# EAGLE schematic HA_FONA_LARA_20 (EAGLE 9.6.1)
COMPANY: Hardware Art; DRAWN: SMT; REV: A
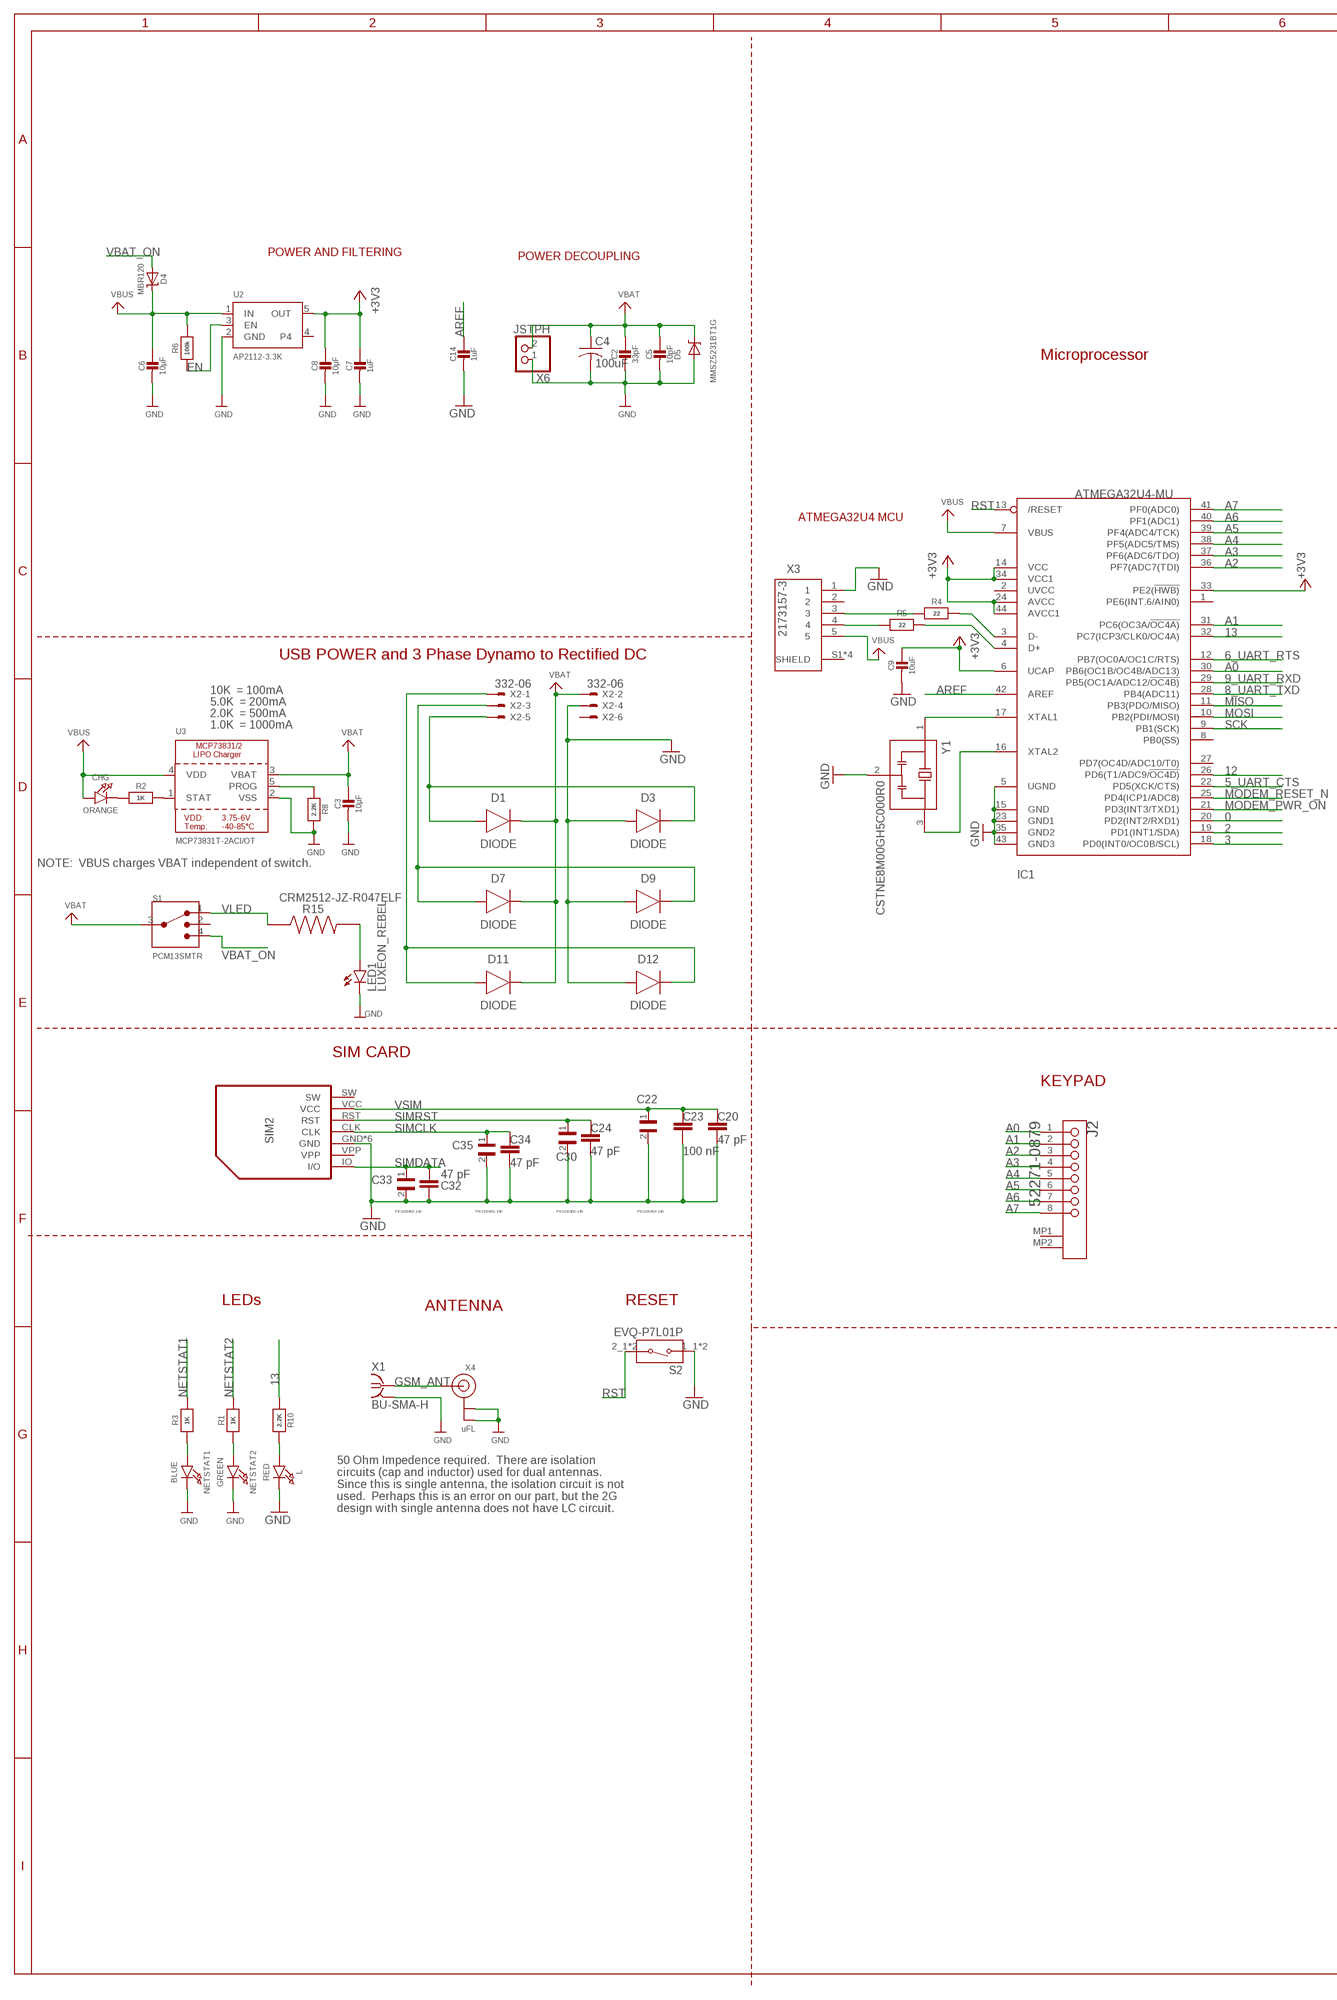
[diagram p0: schematic, sheet 1, part 1 of 2]
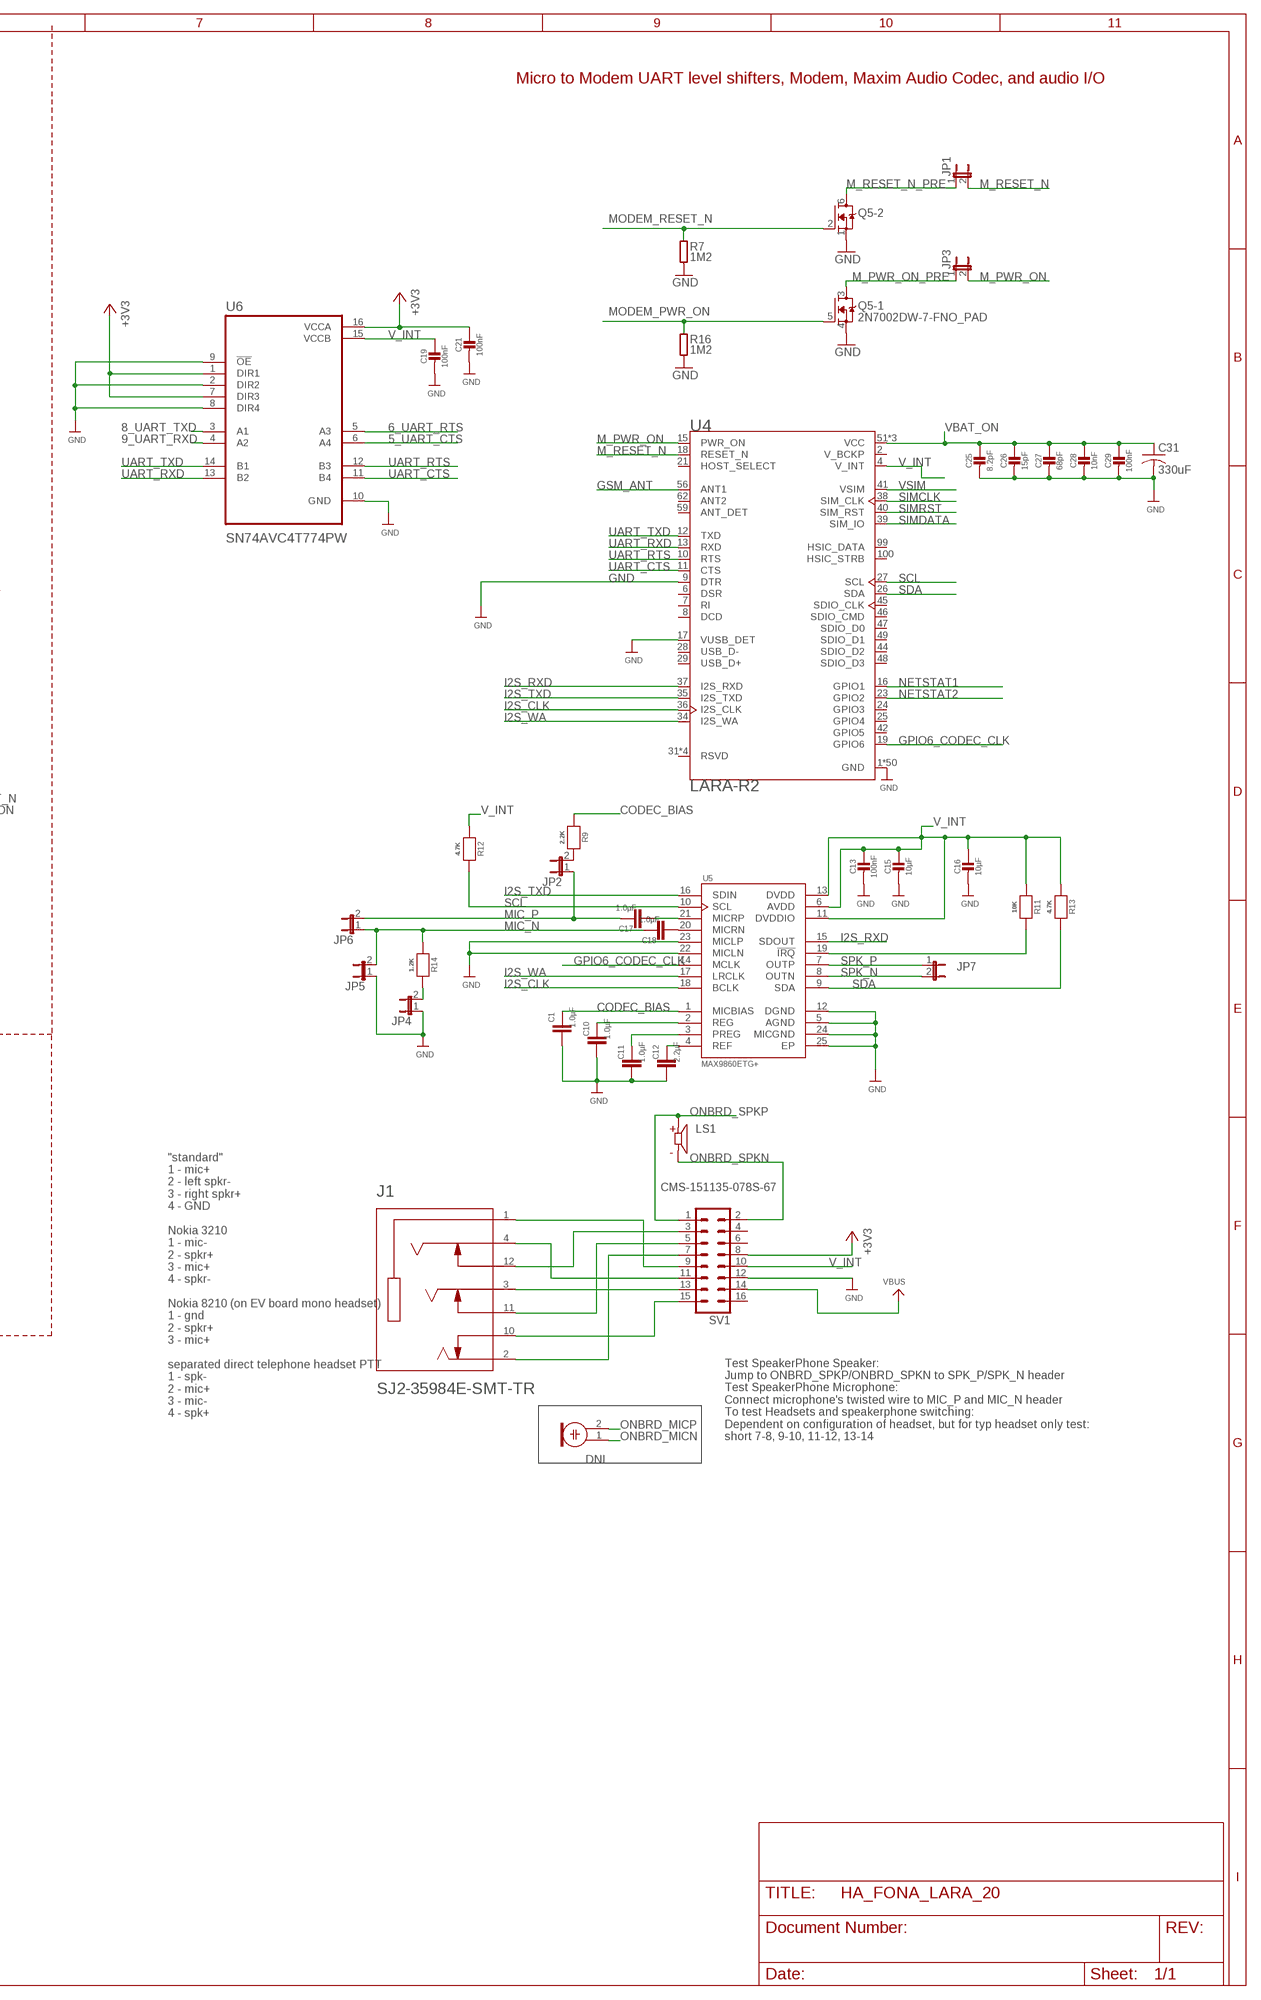
[diagram p1: schematic, sheet 1, part 2 of 2]

## Parts
C1  1.0µF  C_CHIP-0402(1005-METRIC)  [CAPC1005X60]
C2  33pF  CAP_CERAMIC0805-NOOUTLINE  [0805-NO]
C3  10µF  CAP_CERAMIC0805-NOOUTLINE  [0805-NO]
C4  100uF  C-USC1210  [C1210]
C5  10pF  CAP_CERAMIC0805-NOOUTLINE  [0805-NO]
C6  10µF  CAP_CERAMIC0805-NOOUTLINE  [0805-NO]
C7  1uF  CAP_CERAMIC0603_NO  [0603-NO]
C8  10µF  CAP_CERAMIC0805-NOOUTLINE  [0805-NO]
C9  10uF  CAP_CERAMIC_0805MP  [_0805MP]
C10  1.0µF  C_CHIP-0402(1005-METRIC)  [CAPC1005X60]
C11  1.0µF  C_CHIP-0402(1005-METRIC)  [CAPC1005X60]
C12  2.2µF  C_CHIP-0603(1608-METRIC)  [CAPC1608X85]
C13  100nF  CAP_CERAMIC0805-NOOUTLINE  [0805-NO]
C14  1uF  CAP_CERAMIC0603_NO  [0603-NO]
C15  10µF  CAP_CERAMIC0805-NOOUTLINE  [0805-NO]
C16  10µF  CAP_CERAMIC0805-NOOUTLINE  [0805-NO]
C17  1.0µF  C_CHIP-0402(1005-METRIC)  [CAPC1005X60]
C18  1.0µF  C_CHIP-0402(1005-METRIC)  [CAPC1005X60]
C19  100nF  CAP_CERAMIC_0402  [_0402]
C20  47 pF  C_CHIP-0402(1005-METRIC)  [CAPC1005X60]
C21  100nF  CAP_CERAMIC_0402  [_0402]
C22  PESD0402-140  [RESC1005X35N]
C23  100 nF  C_CHIP-0402(1005-METRIC)  [CAPC1005X60]
C24  47 pF  C_CHIP-0402(1005-METRIC)  [CAPC1005X60]
C25  8.2pF  CAP_CERAMIC_0402  [_0402]
C26  15pF  CAP_CERAMIC_0402  [_0402]
C27  68pF  CAP_CERAMIC_0402  [_0402]
C28  10nF  CAP_CERAMIC_0402  [_0402]
C29  100nF  CAP_CERAMIC_0402  [_0402]
C30  PESD0402-140  [RESC1005X35N]
C31  330uF  C-USC1210  [C1210]
C32  47 pF  C_CHIP-0402(1005-METRIC)  [CAPC1005X60]
C33  PESD0402-140  [RESC1005X35N]
C34  47 pF  C_CHIP-0402(1005-METRIC)  [CAPC1005X60]
C35  PESD0402-140  [RESC1005X35N]
CHG  ORANGE  LED0805_NOOUTLINE  [CHIPLED_0805_NOOUTLINE]
D1  DIODE  DIODEDO-214AA(SMB)  [DIOM5336X265N]
D3  DIODE  DIODEDO-214AA(SMB)  [DIOM5336X265N]
D4  MBR120  DIODE-SCHOTTKYSOD-123  [SOD-123]
D5  MMSZ5231BT1G  DIODE-ZENERSOD123  [SOD-123]
D7  DIODE  DIODEDO-214AA(SMB)  [DIOM5336X265N]
D9  DIODE  DIODEDO-214AA(SMB)  [DIOM5336X265N]
D11  DIODE  DIODEDO-214AA(SMB)  [DIOM5336X265N]
D12  DIODE  DIODEDO-214AA(SMB)  [DIOM5336X265N]
IC1  ATMEGA32U4-MU  [TQFN44_7MM]
J1  SJ2-35984E-SMT-TR  [CUI_SJ2-35984E-SMT-TR]
J2  MOLEX_52271-0879MOLEX_52271-0879_0_0  [MOLEX_52271-0879_0]
JP1  JP1E  [JP1]
JP2  JP1E  [JP1]
JP3  JP1E  [JP1]
JP4  JP1E  [JP1]
JP5  JP1E  [JP1]
JP6  JP1E  [JP1]
JP7  JP1E  [JP1]
L  RED  MICROBUILDER_LED0603  [MICROBUILDER_CHIPLED_0603]
LED1  LUXEON_REBEL  [LUXEON_REBEL]
LS1  CMS-151135-078S-67  [SPKR_CMS-151135-078S-67]
M2  ELECTRET_MICROPHON-WM-61A  [WM-61A]
NETSTAT1  BLUE  LED0805_NOOUTLINE  [CHIPLED_0805_NOOUTLINE]
NETSTAT2  GREEN  LED0805_NOOUTLINE  [CHIPLED_0805_NOOUTLINE]
Q5  2N7002DW-7-FNO_PAD  [PWR_SC70-6L2]
R1  1K  RESISTOR_0603_NOOUT  [0603-NO]
R2  1K  RESISTOR_0603_NOOUT  [0603-NO]
R3  1K  RESISTOR_0603_NOOUT  [0603-NO]
R4  22  RESISTOR_0603_NOOUT  [0603-NO]
R5  22  RESISTOR_0603_NOOUT  [0603-NO]
R6  100k  RESISTOR_0603_NOOUT  [0603-NO]
R7  1M2  R-1M2-0402  [0402-1005X55N]
R8  2.2K  RESISTOR_0603_NOOUT  [0603-NO]
R9  2.2K  RESISTOR_0603_NOOUT  [0603-NO]
R10  2.2K  RESISTOR_0603_NOOUT  [0603-NO]
R11  10K  RESISTOR_0603_NOOUT  [0603-NO]
R12  4.7K  RESISTOR_0603_NOOUT  [0603-NO]
R13  4.7K  RESISTOR_0603_NOOUT  [0603-NO]
R14  1.2K  RESISTOR_0603_NOOUT  [0603-NO]
R15  CRM2512-JZ-R047ELF  [RESC6331X80N]
R16  1M2  R-1M2-0402  [0402-1005X55N]
S1  PCM13SMTR  [SW_PCM13SMTR]
S2  EVQ-P7L01P  [SW_EVQ-P7L01P]
SIM2  -  SIM  [MICROSIM8]
SV1  MA08-2  [MA08-2]
U2  AP2112-3.3K  VREG_SOT23-5  [SOT23-5]
U3  MCP73831T-2ACI/OT  MCP73831/2  [SOT23-5]
U4  LARA-R2  [XCVR_LARA-R2]
U5  MAX9860ETG+  [QFN50P400X400X75-25N]
U6  SN74AVC4T774PW  [SOP65P640X120-16N]
X1  BU-SMA-H  [BU-SMA-H]
X2  332-06  [332-06]
X3  2173157-3  [CONN_2173157-3]
X4  uFL  ANTENNA_U.FL  [U.FL]
X6  JSTPH  CON_JST_PH_2PIN  [JSTPH2]
Y1  CSTNE8M00GH5C000R0  [OSC_CSTNE8M00GH5C000R0]

## Nets
0: IC1.20(PD2(INT2/RXD1))
2: IC1.19(PD1(INT1/SDA))
3: IC1.18(PD0(INT0/OC0B/SCL))
5_UART_CTS: IC1.22(PD5(XCK/CTS)) U6.6(A4)
6_UART_RTS: IC1.12(PB7(OC0A/OC1C/RTS)) U6.5(A3)
8_UART_TXD: IC1.28(PB4(ADC11)) U6.3(A1)
9_UART_RXD: IC1.29(PB5(OC1A/ADC12/!OC4B)) U6.4(A2)
12: IC1.26(PD6(T1/ADC9/!OC4D))
13: IC1.32(PC7(ICP3/CLK0/OC4A)) R10.1
+3V3: C7.1 C8.1 C9.1 C21.1 IC1.6(UCAP) IC1.14(VCC) IC1.24(AVCC) IC1.33(PE2(!HWB)) IC1.34(VCC1) IC1.44(AVCC1) SV1.8 U2.5(OUT) U6.1(DIR1) U6.7(DIR3) U6.16(VCCA)
A0: IC1.30(PB6(OC1B/OC4B/ADC13)) J2.1
A1: IC1.31(PC6(OC3A/!OC4A)) J2.2
A2: IC1.36(PF7(ADC7(TDI)) J2.3
A3: IC1.37(PF6(ADC6/TDO)) J2.4
A4: IC1.38(PF5(ADC5/TMS)) J2.5
A5: IC1.39(PF4(ADC4/TCK)) J2.6
A6: IC1.40(PF1(ADC1)) J2.7
A7: IC1.41(PF0(ADC0)) J2.8
AREF: C14.1 IC1.42(AREF)
CODEC_BIAS: C1.1 R9.1 U5.1(MICBIAS)
D+: IC1.4(D+) R5.2
D-: IC1.3(D-) R4.2
EN: R6.1 U2.3(EN)
GND: C1.2 C2.2 C3.2 C4.2 C5.2 C6.2 C7.2 C8.2 C9.2 C10.2 C11.2 C12.2 C13.2 C14.2 C15.2 C16.2 C19.2 C20.2 C21.2 C22.2 C23.2 C24.2 C25.2 C26.2 C27.2 C28.2 C29.2 C30.2 C31.2 C32.2 C33.2 C34.2 C35.2 D3.2(A) D5.A D9.2(A) D12.2(A) IC1.5(UGND) IC1.15(GND) IC1.23(GND1) IC1.35(GND2) IC1.43(GND3) JP4.1 JP5.1 L.C LED1.C LED1.C@1(C) NETSTAT1.C NETSTAT2.C Q5.1(-2:S) Q5.4(-1:S) R7.1 R8.2 R16.1 S2.1_1 S2.1_2 SIM2.GND SIM2.SH1(GND) SIM2.SH2(GND) SIM2.SH3(GND) SIM2.SH4(GND) SIM2.SH5(GND) SV1.12 U2.2(GND) U3.2(VSS) U4.1(GND) U4.3(GND) U4.5(GND) U4.9(DTR) U4.14(GND) U4.17(VUSB_DET) U4.20(GND) U4.22(GND) U4.30(GND) U4.32(GND) U4.43(GND) U4.50(GND) U4.54(GND) U4.55(GND) U4.57(GND) U4.58(GND) U4.60(GND) U4.61(GND) U4.63(GND) U4.64(GND) U4.65(GND) U4.66(GND) U4.67(GND) U4.68(GND) U4.69(GND) U4.70(GND) U4.71(GND) U4.72(GND) U4.73(GND) U4.74(GND) U4.75(GND) U4.76(GND) U4.77(GND) U4.78(GND) U4.79(GND) U4.80(GND) U4.81(GND) U4.82(GND) U4.83(GND) U4.84(GND) U4.85(GND) U4.86(GND) U4.87(GND) U4.88(GND) U4.89(GND) U4.90(GND) U4.91(GND) U4.92(GND) U4.93(GND) U4.94(GND) U4.95(GND) U4.96(GND) U5.5(AGND) U5.12(DGND) U5.22(MICLN) U5.23(MICLP) U5.24(MICGND) U5.25(EP) U6.2(DIR2) U6.8(DIR4) U6.9(!OE) U6.10(GND) X1.2 X1.3 X1.4 X1.5 X2.4 X3.1 X4.1(GND) X4.2(GND) X6.1 Y1.2(GND)
GPIO6_CODEC_CLK: U4.19(GPIO6) U5.14(MCLK)
GSM_ANT: U4.56(ANT1) X1.1 X4.3(SIGNAL)
I2S_CLK: U4.36(I2S_CLK) U5.18(BCLK)
I2S_RXD: U4.37(I2S_RXD) U5.15(SDOUT)
I2S_TXD: U4.35(I2S_TXD) U5.16(SDIN)
I2S_WA: U4.34(I2S_WA) U5.17(LRCLK)
M_PWR_ON: JP3.2 U4.15(PWR_ON)
M_PWR_ON_PRE: JP3.1 Q5.3(-1:D)
M_RESET_N: JP1.2 U4.18(RESET_N)
M_RESET_N_PRE: JP1.1 Q5.6(-2:D)
MIC_N: C18.1 JP5.2 JP6.1 R14.1
MIC_P: C17.1 JP2.1 JP6.2
MISO: IC1.11(PB3(PDO/MISO))
MODEM_PWR_ON: IC1.21(PD3(INT3/TXD1)) Q5.5(-1:G) R16.2
MODEM_RESET_N: IC1.25(PD4(ICP1/ADC8)) Q5.2(-2:G) R7.2
MOSI: IC1.10(PB2(PDI/MOSI))
N$1: CHG.C R2.1
N$2: L.A R10.2
N$3: R2.2 U3.1(STAT)
N$4: R8.1 U3.5(PROG)
N$5: NETSTAT2.A R1.1
N$6: D11.2(A) D12.1(C) X2.1
N$8: C17.2 U5.21(MICRP)
N$9: NETSTAT1.A R3.1
N$10: C12.1 U5.4(REF)
N$11: IC1.16(XTAL2) Y1.3(OUT)
N$12: IC1.17(XTAL1) Y1.1(IN)
N$13: C11.1 U5.3(PREG)
N$14: C10.1 U5.2(REG)
N$15: R5.1 X3.4
N$16: R4.1 X3.3
N$17: C18.2 U5.20(MICRN)
N$18: R11.2 U5.19(!IRQ)
N$20: JP2.2 R9.2
N$21: JP4.2 R14.2
N$22: D7.2(A) D9.1(C) X2.3
N$23: D1.2(A) D3.1(C) X2.5
N$24: J1.11(RING1_SWITCH) SV1.5
N$25: LED1.A LED1.A@1(A) R15.2
N$26: J1.12(RING2_SWITCH) SV1.3
N$27: J1.2(TIP) SV1.7
N$28: J1.1(SLEEVE) SV1.9
N$29: J1.4(RING2) SV1.11
N$30: J1.3(RING1) SV1.13
N$31: J1.10(TIP_SWITCH) SV1.15
NETSTAT1: R3.2 U4.16(GPIO1)
NETSTAT2: R1.2 U4.23(GPIO2)
ONBRD_MICN: M2.1
ONBRD_MICP: M2.2
ONBRD_SPKN: LS1.M SV1.2
ONBRD_SPKP: LS1.P SV1.1
RST: IC1.13(/RESET) S2.2_1 S2.2_2
SCK: IC1.9(PB1(SCK))
SCL: R12.2 U4.27(SCL) U5.10(SCL)
SDA: R13.2 U4.26(SDA) U5.9(SDA)
SIMCLK: C34.1 C35.1 SIM2.CLK U4.38(SIM_CLK)
SIMDATA: C32.1 C33.1 SIM2.IO(I/O) U4.39(SIM_IO)
SIMRST: C24.1 C30.1 SIM2.RST U4.40(SIM_RST)
SPK_N: JP7.2 U5.8(OUTN)
SPK_P: JP7.1 U5.7(OUTP)
UART_CTS: U4.11(CTS) U6.11(B4)
UART_RTS: U4.10(RTS) U6.12(B3)
UART_RXD: U4.13(RXD) U6.13(B2)
UART_TXD: U4.12(TXD) U6.14(B1)
V_INT: C13.1 C15.1 C16.1 C19.1 R11.1 R12.1 R13.1 SV1.10 U4.4(V_INT) U5.6(AVDD) U5.11(DVDDIO) U5.13(DVDD) U6.15(VCCB)
VBAT: C2.1 C3.1 C4.1 C5.1 D1.1(C) D5.C D7.1(C) D11.1(C) S1.3 U3.3(VBAT) X2.2 X6.2
VBAT_ON: C25.1 C26.1 C27.1 C28.1 C29.1 C31.1 D4.A S1.4 U4.51(VCC) U4.52(VCC) U4.53(VCC)
VBUS: C6.1 CHG.A D4.C IC1.7(VBUS) R6.2 SV1.14 U2.1(IN) U3.4(VDD) X3.5
VLED: R15.1 S1.1
VSIM: C20.1 C22.1 C23.1 SIM2.VCC U4.41(VSIM)
Unconnected: IC1.1(PE6(INT.6/AIN0)) IC1.2(UVCC) IC1.8(PB0(SS)) IC1.27(PD7(OC4D/ADC10/T0)) J2.MP1 J2.MP2 LED1.TH LED1.TH@1(TH) LED1.TH@2(TH) LED1.TH@3(TH) LED1.TH@4(TH) S1.2 SIM2.SW SIM2.VPP SV1.4 SV1.6 SV1.16 U2.4 U4.6(DSR) U4.7(RI) U4.8(DCD) U4.21(HOST_SELECT) U4.24(GPIO3) U4.25(GPIO4) U4.28(USB_D-) U4.29(USB_D+) U4.31(RSVD) U4.33(RSVD) U4.42(GPIO5) U4.44(SDIO_D2) U4.45(SDIO_CLK) U4.46(SDIO_CMD) U4.47(SDIO_D0) U4.48(SDIO_D3) U4.49(SDIO_D1) U4.59(ANT_DET) U4.62(ANT2) U4.97(RSVD) U4.98(RSVD) U4.99(HSIC_DATA) U4.100(HSIC_STRB) X2.6 X3.2 X3.S1(SHIELD) X3.S2(SHIELD) X3.S3(SHIELD) X3.S4(SHIELD)

## Notes on the sheet
- Micro to Modem UART level shifters, Modem, Maxim Audio Codec, and audio I/O
- POWER AND FILTERING | POWER DECOUPLING
- Microprocessor
- ATMEGA32U4 MCU
- USB POWER and 3 Phase Dynamo to Rectified DC
- 10K  = 100mA
- 5.0K  = 200mA
- 2.0K  = 500mA
- 1.0K  = 1000mA
- NOTE:  VBUS charges VBAT independent of switch.
- SIM CARD
- KEYPAD
- LEDs | ANTENNA | RESET
- "standard"
  1 - mic+
  2 - left spkr-
  3 - right spkr+
  4 - GND
  
  Nokia 3210
  1 - mic-
  2 - spkr+
  3 - mic+
  4 - spkr-
  
  Nokia 8210 (on EV board mono headset)
  1 - gnd
  2 - spkr+
  3 - mic+
  
  separated direct telephone headset PTT
  1 - spk-
  2 - mic+
  3 - mic-
  4 - spk+
- Test SpeakerPhone Speaker:
  Jump to ONBRD_SPKP/ONBRD_SPKN to SPK_P/SPK_N header
  Test SpeakerPhone Microphone:
  Connect microphone's twisted wire to MIC_P and MIC_N header
  To test Headsets and speakerphone switching:
  Dependent on configuration of headset, but for typ headset only test: 
  short 7-8, 9-10, 11-12, 13-14
- DNI
- 50 Ohm Impedence required.  There are isolation
  circuits (cap and inductor) used for dual antennas.
  Since this is single antenna, the isolation circuit is not
  used.  Perhaps this is an error on our part, but the 2G
  design with single antenna does not have LC circuit.

## Power pins joined to a net without a drawn wire
V_BCKP: U4.2(V_BCKP)

## Library data of the parts
C1 C12 = Capacitor:C: Capacitor - Generic; CATEGORY: Capacitor; MF: KEMET; MPN: T491A225K016AT; OC_NEWARK: 97H5553
C2 = microbuilder:CAP_CERAMIC: Ceramic Capacitors For new designs, use the packages preceded by an '_' character since they are more reliable: The following footprints should be used on most boards: _0402 - Standard footprint for regular board layouts _0603 - Standard footprint for regular board layouts _0805 - Standard footprint for regular board layouts _1206 - Standard footprint for regular board layouts For extremely tight-pitch boards where space is at a premium, the following 'micro-pitch' footprints can be used (smaller pads, no silkscreen outline, etc.): _0402MP - Micro-pitch footprint for very dense/compact boards _0603MP - Micro-pitch footprint for very dense/compact boards _0805MP - Micro-pitch footprint for very dense/compact boards _1206MP - Micro-pitch footprint for very dense/compact boards; MF: AVX; MPN: 04025A330JAT2A; OC_NEWARK: 96M1150
C3 C6 C8 C9 C15 C16 = microbuilder:CAP_CERAMIC: Ceramic Capacitors For new designs, use the packages preceded by an '_' character since they are more reliable: The following footprints should be used on most boards: _0402 - Standard footprint for regular board layouts _0603 - Standard footprint for regular board layouts _0805 - Standard footprint for regular board layouts _1206 - Standard footprint for regular board layouts For extremely tight-pitch boards where space is at a premium, the following 'micro-pitch' footprints can be used (smaller pads, no silkscreen outline, etc.): _0402MP - Micro-pitch footprint for very dense/compact boards _0603MP - Micro-pitch footprint for very dense/compact boards _0805MP - Micro-pitch footprint for very dense/compact boards _1206MP - Micro-pitch footprint for very dense/compact boards; MF: AVX; MPN: 08053D106KAT2A; OC_NEWARK: 37T9053
C4 = rcl:C-US: CAPACITOR, American symbol; MF: KEMET; MPN: C1210C107M8PACTU; OC_NEWARK: 87X8674
C5 = microbuilder:CAP_CERAMIC: Ceramic Capacitors For new designs, use the packages preceded by an '_' character since they are more reliable: The following footprints should be used on most boards: _0402 - Standard footprint for regular board layouts _0603 - Standard footprint for regular board layouts _0805 - Standard footprint for regular board layouts _1206 - Standard footprint for regular board layouts For extremely tight-pitch boards where space is at a premium, the following 'micro-pitch' footprints can be used (smaller pads, no silkscreen outline, etc.): _0402MP - Micro-pitch footprint for very dense/compact boards _0603MP - Micro-pitch footprint for very dense/compact boards _0805MP - Micro-pitch footprint for very dense/compact boards _1206MP - Micro-pitch footprint for very dense/compact boards; MF: KEMET; MPN: C0805C100D5GACTU; OC_NEWARK: 07X0850
C7 C14 = microbuilder:CAP_CERAMIC: Ceramic Capacitors For new designs, use the packages preceded by an '_' character since they are more reliable: The following footprints should be used on most boards: _0402 - Standard footprint for regular board layouts _0603 - Standard footprint for regular board layouts _0805 - Standard footprint for regular board layouts _1206 - Standard footprint for regular board layouts For extremely tight-pitch boards where space is at a premium, the following 'micro-pitch' footprints can be used (smaller pads, no silkscreen outline, etc.): _0402MP - Micro-pitch footprint for very dense/compact boards _0603MP - Micro-pitch footprint for very dense/compact boards _0805MP - Micro-pitch footprint for very dense/compact boards _1206MP - Micro-pitch footprint for very dense/compact boards; MF: AVX; MPN: 02016D104KAT2A; OC_NEWARK: 85K9474
C10 C11 C17 C18 = Capacitor:C: Capacitor - Generic; CATEGORY: Capacitor; MF: AVX; MPN: 02016D104KAT2A; OC_NEWARK: 85K9474
C13 = microbuilder:CAP_CERAMIC: Ceramic Capacitors For new designs, use the packages preceded by an '_' character since they are more reliable: The following footprints should be used on most boards: _0402 - Standard footprint for regular board layouts _0603 - Standard footprint for regular board layouts _0805 - Standard footprint for regular board layouts _1206 - Standard footprint for regular board layouts For extremely tight-pitch boards where space is at a premium, the following 'micro-pitch' footprints can be used (smaller pads, no silkscreen outline, etc.): _0402MP - Micro-pitch footprint for very dense/compact boards _0603MP - Micro-pitch footprint for very dense/compact boards _0805MP - Micro-pitch footprint for very dense/compact boards _1206MP - Micro-pitch footprint for very dense/compact boards; MF: AVX; MPN: 08055C104KAT2A; OC_NEWARK: 95W1480
C19 C21 C29 = microbuilder:CAP_CERAMIC: Ceramic Capacitors For new designs, use the packages preceded by an '_' character since they are more reliable: The following footprints should be used on most boards: _0402 - Standard footprint for regular board layouts _0603 - Standard footprint for regular board layouts _0805 - Standard footprint for regular board layouts _1206 - Standard footprint for regular board layouts For extremely tight-pitch boards where space is at a premium, the following 'micro-pitch' footprints can be used (smaller pads, no silkscreen outline, etc.): _0402MP - Micro-pitch footprint for very dense/compact boards _0603MP - Micro-pitch footprint for very dense/compact boards _0805MP - Micro-pitch footprint for very dense/compact boards _1206MP - Micro-pitch footprint for very dense/compact boards; MF: TDK; MPN: C1005X7R1C104K050BC; OC_NEWARK: 90R7598
C20 C23 C24 C32 C34 = Capacitor:C: Capacitor - Generic; CATEGORY: Capacitor
C22 C30 C33 C35 = PESD0402-140:PESD0402-140: PESD0402 Series 40 V 0.25 pF Bi-Directional Surface Mount ESD Protector Check prices <https://pricing.snapeda.com/search/part/PESD0402-140/?ref=eda>; AVAILABILITY: Good; DESCRIPTION: 40V Clamp Ipp Tvs Diode Surface Mount 0402; MF: Littelfuse Inc.; MP: PESD0402-140; PACKAGE: 0402 Littelfuse; PRICE: None; PURCHASE-URL: https://pricing.snapeda.com/search/part/PESD0402-140/?ref=eda
C25 = microbuilder:CAP_CERAMIC: Ceramic Capacitors For new designs, use the packages preceded by an '_' character since they are more reliable: The following footprints should be used on most boards: _0402 - Standard footprint for regular board layouts _0603 - Standard footprint for regular board layouts _0805 - Standard footprint for regular board layouts _1206 - Standard footprint for regular board layouts For extremely tight-pitch boards where space is at a premium, the following 'micro-pitch' footprints can be used (smaller pads, no silkscreen outline, etc.): _0402MP - Micro-pitch footprint for very dense/compact boards _0603MP - Micro-pitch footprint for very dense/compact boards _0805MP - Micro-pitch footprint for very dense/compact boards _1206MP - Micro-pitch footprint for very dense/compact boards; MF: NIC COMPONENTS; MPN: NMC0402NPO8R2C50TRPF; OC_NEWARK: 18AH4170
C26 = microbuilder:CAP_CERAMIC: Ceramic Capacitors For new designs, use the packages preceded by an '_' character since they are more reliable: The following footprints should be used on most boards: _0402 - Standard footprint for regular board layouts _0603 - Standard footprint for regular board layouts _0805 - Standard footprint for regular board layouts _1206 - Standard footprint for regular board layouts For extremely tight-pitch boards where space is at a premium, the following 'micro-pitch' footprints can be used (smaller pads, no silkscreen outline, etc.): _0402MP - Micro-pitch footprint for very dense/compact boards _0603MP - Micro-pitch footprint for very dense/compact boards _0805MP - Micro-pitch footprint for very dense/compact boards _1206MP - Micro-pitch footprint for very dense/compact boards; MF: MULTICOMP PRO; MPN: MCMT15N150F500CT; OC_NEWARK: 03AC2879
C27 = microbuilder:CAP_CERAMIC: Ceramic Capacitors For new designs, use the packages preceded by an '_' character since they are more reliable: The following footprints should be used on most boards: _0402 - Standard footprint for regular board layouts _0603 - Standard footprint for regular board layouts _0805 - Standard footprint for regular board layouts _1206 - Standard footprint for regular board layouts For extremely tight-pitch boards where space is at a premium, the following 'micro-pitch' footprints can be used (smaller pads, no silkscreen outline, etc.): _0402MP - Micro-pitch footprint for very dense/compact boards _0603MP - Micro-pitch footprint for very dense/compact boards _0805MP - Micro-pitch footprint for very dense/compact boards _1206MP - Micro-pitch footprint for very dense/compact boards; MF: KEMET; MPN: C0603C680J3GACAUTO; OC_NEWARK: 77Y7549
C28 = microbuilder:CAP_CERAMIC: Ceramic Capacitors For new designs, use the packages preceded by an '_' character since they are more reliable: The following footprints should be used on most boards: _0402 - Standard footprint for regular board layouts _0603 - Standard footprint for regular board layouts _0805 - Standard footprint for regular board layouts _1206 - Standard footprint for regular board layouts For extremely tight-pitch boards where space is at a premium, the following 'micro-pitch' footprints can be used (smaller pads, no silkscreen outline, etc.): _0402MP - Micro-pitch footprint for very dense/compact boards _0603MP - Micro-pitch footprint for very dense/compact boards _0805MP - Micro-pitch footprint for very dense/compact boards _1206MP - Micro-pitch footprint for very dense/compact boards; MF: AVX; MPN: 06035C103KAT2A; OC_NEWARK: 36K3729
C31 = rcl:C-US: CAPACITOR, American symbol; MF: MURATA; MPN: GRM32EC80E337ME05L; OC_NEWARK: 01AC8870
CHG = microbuilder:LED: LED 0603 - 0603 Surface Mount Package 2mA: Green LED - Low Power (3.9mcd, 2ma, 1.7Vf) - Digikey: 475-2709-2-ND Orange LED - Low Power (9.8mcd, 2ma, 1.8Vf) - Digikey: 475-1194-2-ND Red LED - Low Power (5mcd, 2ma, 1.8Vf) - Digikey: 475-1195-2-ND Yellow LED - Low Power (7mcd, 2ma, 1.8Vf) - Digikey: 475-1196-2-ND 5mA: Blue LED - Low Power (17mcd, 5ma, 2.9Vf) - Digikey: LNJ937W8CRACT-ND 0805 - 0805 Surface Mount Package 2mA: Red LED (8.8mcd, 2mA, 1.8Vf, Clear) - Low Power [Digikey: 475-2510-1-ND] Green LED (5mcd, 2mA, 1.8Vf, Clear) - Low Power [Digikey: 475-2730-1-ND] Yellow LED (11.3mcd, 2mA, 1.8Vf, Clear) - Low Power [Digikey: 475-2555-1-ND] 20mA: Red LED (104mcd, 20mA, Diffused) - LS R976 [Digikey: 475-1278-6-ND] Red LED (12mcd, 20mA, 2.0Vf, Clear) - APT2012EC [Digikey: 754-1128-1-ND] Green LED (15mcd, 20mA, 2.2Vf, Clear) - APT2012GC [Digikey: 754-1131-1-ND] Orange LED (160mcd, 20mA, 2.1Vf, Clear) - APT2012SECK [Digikey: 754-1130-1-ND] 1206 - 1206 Surface Mount Package Green LED (26mcd, 20mA, Diffused) - LG N971 [Digikey: 475-1407-6-ND] Red LED (15mcd, 20mA, Diffused) - LH N974 [Digikey: 475-1416-6-ND] Cree - Cree High-Power Surface Mount LEDs XPEBWT-L1-0000-00D50 - White 111lm 350mA 2.9Vf 6200K 110° XTEAWT-00-0000-00000LEE3 - White 114lm 350mA 2.85Vf 5000K 115° Everlight - Everlight 45-21 Series Surface Mount LEDs 45-21/QK2C-B2832AC2CB2/2T - Warm White 2000mcd 20mA 3.25Vf 3050K 120° 45-21/LK2C-B38452C4CB2/2T - Nuetral White 2000mcd 20mA 3.25Vf 4150K 120° 45-21/LK2C-B50634C6CB2/2T - Cold White 2200mcd 20mA 3.25Vf 5650K 120° PLCC2 Reverse Mount LS T77K-J1L2-1-0-2-R18-Z - Red 11.25mcd 2mA 1.8Vf 630nm 120° LO T77K-L1M2-24-Z - Orange 19.6mcd 2mA 1.8Vf 606nm 120° LY T77K-K2M1-26-Z - Yellow 15.7mcd 2mA 1.8Vf 587nm 120°; MF: KINGBRIGHT; MPN: KPT-2012SECK; OC_NEWARK: 93T1600
D1 D3 D7 D9 D11 D12 = Diode:DIODE: Diode Rectifier - Generic; CATEGORY: Diode; OC_NEWARK: unknown; SUB-CATEGORY: Rectifier
D4 = microbuilder:DIODE-SCHOTTKY; MF: ON SEMICONDUCTOR; MPN: MBR120VLSFT1G; OC_NEWARK: 10N9424
D5 = microbuilder:DIODE-ZENER: Zener Diode SMA: 30V 1W Zener Diode, 1.2Vf - Digikey: SMAZ30-FDICT-ND; MF: ON SEMICONDUCTOR; MPN: MMSZ5231BT1G; OC_NEWARK: 83H7426
IC1 = microbuilder:ATMEGA32U4: http://www.ladyada.net/library/eagle; MF: MICROCHIP; MPN: ATMEGA32U4-MU; OC_NEWARK: 15AC6077
J1 = SJ2-35984E-SMT-TR:SJ2-35984E-SMT-TR: 4 conductors, 3.5mm, SMT Audio Jack w/ 3 Switch; MANUFACTURER: CUI; OC_NEWARK: unknown; STANDARD: Manufacturer recommendation
J2 = Molex - 52271-0879:MOLEX_52271-0879: MOLX-52271-0879; CIIVA_IDS: 605436; CIRCUITS_LOADED: 8; COMPONENT_LINK_1_DESCRIPTION: Manufacturer URL; COMPONENT_LINK_1_URL: http://www.molex.com/molex/index.jsp; COMPONENT_LINK_3_DESCRIPTION: Package Specification; COMPONENT_LINK_3_URL: http://www.molex.com/pdm_docs/sd/522710879_sd.pdf; CONTACT_POSITION: Bottom; CURRENT_MAX_PER_CONTACT: 0.5A; DATASHEET: http://www.molex.com/webdocs/datasheets/pdf/en-us/0522710879_FFC_FPC_CONNECTORS.pdf; DURABILITY_MATING_CYCLES_MAX: 30; ENTRY_ANGLE: 90degrees Angle; FOOTPRINT_VARIANT_NAME_0: Manufacturer Recommended; IMPORTED: yes; IMPORTED_FROM: vault; IMPORT_TS: 1521845783; MATED_HEIGHT: 3.00mm; MATERIAL___METAL: Phosphor Bronze; MATERIAL___PLATING_MATING: Tin-Bismuth; MATERIAL___PLATING_TERMINATION: Tin-Bismuth; MF: MOLEX; MOUNTING_TECHNOLOGY: Surface Mount; MPN: 52271-0879-CUT-TAPE; NUMBER_OF_ROWS: 1; OC_NEWARK: 78AC0708; ORIENTATION: Right Angle; PACKAGE: 52271-0879; PACKAGE_DESCRIPTION: 8-Lead FPC Connector, Pitch 1.0 mm; PACKAGE_VERSION: Rev. B, 04/2004; PACKING: Tape and Reel; PCB_LOCATOR: No; PCB_RETENTION: Yes; PITCH___MATING_INTERFACE: 1.00mm; PITCH___TERMINATION_INTERFACE: 1.00mm; POLARIZED_TO_PCB: Yes; PREFIX: J; RELEASE_DATE: 1411372468; ROHS: Yes; STACKABLE: No; VAULT_GUID: 6E0E35AC-EB58-4C9C-8B40-B34D68BAFD49; VAULT_REVISION: B8D0B5D1-BD2E-4A74-BF2B-C0B6D1E0611E; VOLTAGE_MAX: 50V AC (RMS)/DC
JP1-JP7 = jumper:JP1E: JUMPER; OC_NEWARK: unknown
L = HA_FONA_LARA:MICROBUILDER_LED: LED 0603 - 0603 Surface Mount Package 2mA: Green LED - Low Power (3.9mcd, 2ma, 1.7Vf) - Digikey: 475-2709-2-ND Orange LED - Low Power (9.8mcd, 2ma, 1.8Vf) - Digikey: 475-1194-2-ND Red LED - Low Power (5mcd, 2ma, 1.8Vf) - Digikey: 475-1195-2-ND Yellow LED - Low Power (7mcd, 2ma, 1.8Vf) - Digikey: 475-1196-2-ND 5mA: Blue LED - Low Power (17mcd, 5ma, 2.9Vf) - Digikey: LNJ937W8CRACT-ND 0805 - 0805 Surface Mount Package 2mA: Red LED (8.8mcd, 2mA, 1.8Vf, Clear) - Low Power [Digikey: 475-2510-1-ND] Green LED (5mcd, 2mA, 1.8Vf, Clear) - Low Power [Digikey: 475-2730-1-ND] Yellow LED (11.3mcd, 2mA, 1.8Vf, Clear) - Low Power [Digikey: 475-2555-1-ND] 20mA: Red LED (104mcd, 20mA, Diffused) - LS R976 [Digikey: 475-1278-6-ND] Red LED (12mcd, 20mA, 2.0Vf, Clear) - APT2012EC [Digikey: 754-1128-1-ND] Green LED (15mcd, 20mA, 2.2Vf, Clear) - APT2012GC [Digikey: 754-1131-1-ND] Orange LED (160mcd, 20mA, 2.1Vf, Clear) - APT2012SECK [Digikey: 754-1130-1-ND] 1206 - 1206 Surface Mount Package Green LED (26mcd, 20mA, Diffused) - LG N971 [Digikey: 475-1407-6-ND] Red LED (15mcd, 20mA, Diffused) - LH N974 [Digikey: 475-1416-6-ND] Cree - Cree High-Power Surface Mount LEDs XPEBWT-L1-0000-00D50 - White 111lm 350mA 2.9Vf 6200K 110° XTEAWT-00-0000-00000LEE3 - White 114lm 350mA 2.85Vf 5000K 115° Everlight - Everlight 45-21 Series Surface Mount LEDs 45-21/QK2C-B2832AC2CB2/2T - Warm White 2000mcd 20mA 3.25Vf 3050K 120° 45-21/LK2C-B38452C4CB2/2T - Nuetral White 2000mcd 20mA 3.25Vf 4150K 120° 45-21/LK2C-B50634C6CB2/2T - Cold White 2200mcd 20mA 3.25Vf 5650K 120° PLCC2 Reverse Mount LS T77K-J1L2-1-0-2-R18-Z - Red 11.25mcd 2mA 1.8Vf 630nm 120° LO T77K-L1M2-24-Z - Orange 19.6mcd 2mA 1.8Vf 606nm 120° LY T77K-K2M1-26-Z - Yellow 15.7mcd 2mA 1.8Vf 587nm 120°; MF: KINGBRIGHT; MPN: KPT-1608LVSECK-J3-PRV; OC_NEWARK: 94Y5925
LED1 = led:LUXEON_REBEL: LUXEON Rebel Display layer 93, Pins, and connect all contact points with a net. The thermal pads are defined in a separate gate with addlevel REQUEST. Draw a net named 'TH' and connect all thermal pads with it. Please read the Package's Description about DRC settings. Source: http://www.lumileds.com/pdfs/AB32.pdf
LS1 = CMS-151135-078S-67:CMS-151135-078S-67: 15 x 11 mm, Rectangular Frame, 0.7 W, 8 Ohm, Neodymium Magnet, Mylar Cone, Spring Contacts; MANUFACTURER: CUI Inc; OC_NEWARK: unknown; PARTREV: 1.0; STANDARD: Manufacturer Recommendations
M2 = microphon:ELECTRET_MICROPHON-: Electret Condenser Microphone; OC_NEWARK: unknown
NETSTAT1 = microbuilder:LED: LED 0603 - 0603 Surface Mount Package 2mA: Green LED - Low Power (3.9mcd, 2ma, 1.7Vf) - Digikey: 475-2709-2-ND Orange LED - Low Power (9.8mcd, 2ma, 1.8Vf) - Digikey: 475-1194-2-ND Red LED - Low Power (5mcd, 2ma, 1.8Vf) - Digikey: 475-1195-2-ND Yellow LED - Low Power (7mcd, 2ma, 1.8Vf) - Digikey: 475-1196-2-ND 5mA: Blue LED - Low Power (17mcd, 5ma, 2.9Vf) - Digikey: LNJ937W8CRACT-ND 0805 - 0805 Surface Mount Package 2mA: Red LED (8.8mcd, 2mA, 1.8Vf, Clear) - Low Power [Digikey: 475-2510-1-ND] Green LED (5mcd, 2mA, 1.8Vf, Clear) - Low Power [Digikey: 475-2730-1-ND] Yellow LED (11.3mcd, 2mA, 1.8Vf, Clear) - Low Power [Digikey: 475-2555-1-ND] 20mA: Red LED (104mcd, 20mA, Diffused) - LS R976 [Digikey: 475-1278-6-ND] Red LED (12mcd, 20mA, 2.0Vf, Clear) - APT2012EC [Digikey: 754-1128-1-ND] Green LED (15mcd, 20mA, 2.2Vf, Clear) - APT2012GC [Digikey: 754-1131-1-ND] Orange LED (160mcd, 20mA, 2.1Vf, Clear) - APT2012SECK [Digikey: 754-1130-1-ND] 1206 - 1206 Surface Mount Package Green LED (26mcd, 20mA, Diffused) - LG N971 [Digikey: 475-1407-6-ND] Red LED (15mcd, 20mA, Diffused) - LH N974 [Digikey: 475-1416-6-ND] Cree - Cree High-Power Surface Mount LEDs XPEBWT-L1-0000-00D50 - White 111lm 350mA 2.9Vf 6200K 110° XTEAWT-00-0000-00000LEE3 - White 114lm 350mA 2.85Vf 5000K 115° Everlight - Everlight 45-21 Series Surface Mount LEDs 45-21/QK2C-B2832AC2CB2/2T - Warm White 2000mcd 20mA 3.25Vf 3050K 120° 45-21/LK2C-B38452C4CB2/2T - Nuetral White 2000mcd 20mA 3.25Vf 4150K 120° 45-21/LK2C-B50634C6CB2/2T - Cold White 2200mcd 20mA 3.25Vf 5650K 120° PLCC2 Reverse Mount LS T77K-J1L2-1-0-2-R18-Z - Red 11.25mcd 2mA 1.8Vf 630nm 120° LO T77K-L1M2-24-Z - Orange 19.6mcd 2mA 1.8Vf 606nm 120° LY T77K-K2M1-26-Z - Yellow 15.7mcd 2mA 1.8Vf 587nm 120°; MF: KINGBRIGHT; MPN: KPT-2012LVVBC-D; OC_NEWARK: 94Y5933
NETSTAT2 = microbuilder:LED: LED 0603 - 0603 Surface Mount Package 2mA: Green LED - Low Power (3.9mcd, 2ma, 1.7Vf) - Digikey: 475-2709-2-ND Orange LED - Low Power (9.8mcd, 2ma, 1.8Vf) - Digikey: 475-1194-2-ND Red LED - Low Power (5mcd, 2ma, 1.8Vf) - Digikey: 475-1195-2-ND Yellow LED - Low Power (7mcd, 2ma, 1.8Vf) - Digikey: 475-1196-2-ND 5mA: Blue LED - Low Power (17mcd, 5ma, 2.9Vf) - Digikey: LNJ937W8CRACT-ND 0805 - 0805 Surface Mount Package 2mA: Red LED (8.8mcd, 2mA, 1.8Vf, Clear) - Low Power [Digikey: 475-2510-1-ND] Green LED (5mcd, 2mA, 1.8Vf, Clear) - Low Power [Digikey: 475-2730-1-ND] Yellow LED (11.3mcd, 2mA, 1.8Vf, Clear) - Low Power [Digikey: 475-2555-1-ND] 20mA: Red LED (104mcd, 20mA, Diffused) - LS R976 [Digikey: 475-1278-6-ND] Red LED (12mcd, 20mA, 2.0Vf, Clear) - APT2012EC [Digikey: 754-1128-1-ND] Green LED (15mcd, 20mA, 2.2Vf, Clear) - APT2012GC [Digikey: 754-1131-1-ND] Orange LED (160mcd, 20mA, 2.1Vf, Clear) - APT2012SECK [Digikey: 754-1130-1-ND] 1206 - 1206 Surface Mount Package Green LED (26mcd, 20mA, Diffused) - LG N971 [Digikey: 475-1407-6-ND] Red LED (15mcd, 20mA, Diffused) - LH N974 [Digikey: 475-1416-6-ND] Cree - Cree High-Power Surface Mount LEDs XPEBWT-L1-0000-00D50 - White 111lm 350mA 2.9Vf 6200K 110° XTEAWT-00-0000-00000LEE3 - White 114lm 350mA 2.85Vf 5000K 115° Everlight - Everlight 45-21 Series Surface Mount LEDs 45-21/QK2C-B2832AC2CB2/2T - Warm White 2000mcd 20mA 3.25Vf 3050K 120° 45-21/LK2C-B38452C4CB2/2T - Nuetral White 2000mcd 20mA 3.25Vf 4150K 120° 45-21/LK2C-B50634C6CB2/2T - Cold White 2200mcd 20mA 3.25Vf 5650K 120° PLCC2 Reverse Mount LS T77K-J1L2-1-0-2-R18-Z - Red 11.25mcd 2mA 1.8Vf 630nm 120° LO T77K-L1M2-24-Z - Orange 19.6mcd 2mA 1.8Vf 606nm 120° LY T77K-K2M1-26-Z - Yellow 15.7mcd 2mA 1.8Vf 587nm 120°; MF: KINGBRIGHT; MPN: KPT-2012ZGCK; OC_NEWARK: 27X9140
Q5 = Arduino-transistors:2N7002DW-7-F: MOSFET 2N-CH 60V 0.23A SOT-363; DATASHEET: http://www.diodes.com/_files/datasheets/ds30120.pdf; DISTRIBUTOR-LINK: http://www.digikey.com/product-detail/en/diodes-incorporated/2N7002DW-7-F/2N7002DW-FDITR-ND/749948; DISTRIBUTOR-PN: 2N7002DW-FDITR-ND; MANUFACTURER: Diodes Incorporated; MANUFACTURER-PN: 2N7002DW-7-F; OC_NEWARK: unknown
R1-R3 = microbuilder:RESISTOR: Resistors For new designs, use the packages preceded by an '_' character since they are more reliable: The following footprints should be used on most boards: _0402 - Standard footprint for regular board layouts _0603 - Standard footprint for regular board layouts _0805 - Standard footprint for regular board layouts _1206 - Standard footprint for regular board layouts For extremely tight-pitch boards where space is at a premium, the following 'micro-pitch' footprints can be used (smaller pads, no silkscreen outline, etc.): _0402MP - Micro-pitch footprint for very dense/compact boards _0603MP - Micro-pitch footprint for very dense/compact boards _0805MP - Micro-pitch footprint for very dense/compact boards _1206MP - Micro-pitch footprint for very dense/compact boards; MF: PANASONIC; MPN: ERJ3EKF1001V; OC_NEWARK: 85Y8498
R4 R5 = microbuilder:RESISTOR: Resistors For new designs, use the packages preceded by an '_' character since they are more reliable: The following footprints should be used on most boards: _0402 - Standard footprint for regular board layouts _0603 - Standard footprint for regular board layouts _0805 - Standard footprint for regular board layouts _1206 - Standard footprint for regular board layouts For extremely tight-pitch boards where space is at a premium, the following 'micro-pitch' footprints can be used (smaller pads, no silkscreen outline, etc.): _0402MP - Micro-pitch footprint for very dense/compact boards _0603MP - Micro-pitch footprint for very dense/compact boards _0805MP - Micro-pitch footprint for very dense/compact boards _1206MP - Micro-pitch footprint for very dense/compact boards; OC_NEWARK: unknown
R6 = microbuilder:RESISTOR: Resistors For new designs, use the packages preceded by an '_' character since they are more reliable: The following footprints should be used on most boards: _0402 - Standard footprint for regular board layouts _0603 - Standard footprint for regular board layouts _0805 - Standard footprint for regular board layouts _1206 - Standard footprint for regular board layouts For extremely tight-pitch boards where space is at a premium, the following 'micro-pitch' footprints can be used (smaller pads, no silkscreen outline, etc.): _0402MP - Micro-pitch footprint for very dense/compact boards _0603MP - Micro-pitch footprint for very dense/compact boards _0805MP - Micro-pitch footprint for very dense/compact boards _1206MP - Micro-pitch footprint for very dense/compact boards; MF: MULTICOMP PRO; MPN: MCWR06X1003FTL; OC_NEWARK: 94X1381
R7 R16 = Arduino-rcl:R: SMD Resistor; CODE-ARDUINO: 2352; DATASHEET: www.yageo.com.tw/exep/pages/download/literatures/PYu-R_INT-thick_7.pdf; DISTRIBUTOR-LINK: http://www.digikey.com/products/en?keywords=RC0402FR-071M2L-ND; DISTRIBUTOR-PN: RC0402FR-071M2L-ND; MANUFACTURER: Yageo; MANUFACTURER-PN: RC0402FR-071M2L; MF: MULTICOMP PRO; MPN: MCHVR02FTFY1204; NOTE: NO; OC_NEWARK: 46AC9958
R8-R10 = microbuilder:RESISTOR: Resistors For new designs, use the packages preceded by an '_' character since they are more reliable: The following footprints should be used on most boards: _0402 - Standard footprint for regular board layouts _0603 - Standard footprint for regular board layouts _0805 - Standard footprint for regular board layouts _1206 - Standard footprint for regular board layouts For extremely tight-pitch boards where space is at a premium, the following 'micro-pitch' footprints can be used (smaller pads, no silkscreen outline, etc.): _0402MP - Micro-pitch footprint for very dense/compact boards _0603MP - Micro-pitch footprint for very dense/compact boards _0805MP - Micro-pitch footprint for very dense/compact boards _1206MP - Micro-pitch footprint for very dense/compact boards; MF: YAGEO; MPN: RC0603FR-072K2L.; OC_NEWARK: 75X0144
R11 = microbuilder:RESISTOR: Resistors For new designs, use the packages preceded by an '_' character since they are more reliable: The following footprints should be used on most boards: _0402 - Standard footprint for regular board layouts _0603 - Standard footprint for regular board layouts _0805 - Standard footprint for regular board layouts _1206 - Standard footprint for regular board layouts For extremely tight-pitch boards where space is at a premium, the following 'micro-pitch' footprints can be used (smaller pads, no silkscreen outline, etc.): _0402MP - Micro-pitch footprint for very dense/compact boards _0603MP - Micro-pitch footprint for very dense/compact boards _0805MP - Micro-pitch footprint for very dense/compact boards _1206MP - Micro-pitch footprint for very dense/compact boards; MF: VISHAY; MPN: CRCW060310K0FKEA; OC_NEWARK: 52K8063
R12 R13 = microbuilder:RESISTOR: Resistors For new designs, use the packages preceded by an '_' character since they are more reliable: The following footprints should be used on most boards: _0402 - Standard footprint for regular board layouts _0603 - Standard footprint for regular board layouts _0805 - Standard footprint for regular board layouts _1206 - Standard footprint for regular board layouts For extremely tight-pitch boards where space is at a premium, the following 'micro-pitch' footprints can be used (smaller pads, no silkscreen outline, etc.): _0402MP - Micro-pitch footprint for very dense/compact boards _0603MP - Micro-pitch footprint for very dense/compact boards _0805MP - Micro-pitch footprint for very dense/compact boards _1206MP - Micro-pitch footprint for very dense/compact boards; MF: PANASONIC; MPN: ERJ-3EKF4701V; OC_NEWARK: 64R5349
R14 = microbuilder:RESISTOR: Resistors For new designs, use the packages preceded by an '_' character since they are more reliable: The following footprints should be used on most boards: _0402 - Standard footprint for regular board layouts _0603 - Standard footprint for regular board layouts _0805 - Standard footprint for regular board layouts _1206 - Standard footprint for regular board layouts For extremely tight-pitch boards where space is at a premium, the following 'micro-pitch' footprints can be used (smaller pads, no silkscreen outline, etc.): _0402MP - Micro-pitch footprint for very dense/compact boards _0603MP - Micro-pitch footprint for very dense/compact boards _0805MP - Micro-pitch footprint for very dense/compact boards _1206MP - Micro-pitch footprint for very dense/compact boards; MF: VISHAY; MPN: CRCW06031K20FKEA; OC_NEWARK: 52K8025
R15 = CRM2512-JZ-R047ELF:CRM2512-JZ-R047ELF: RES SMD 47 MOHM 5% 2W 2512; AVAILABILITY: Unavailable; DESCRIPTION: Res .047 Ohm 2w 5% 2512 Smd; MP: CRM2512-JZ-R047ELF; OC_NEWARK: unknown; PACKAGE: 6331 Bourns; PRICE: None
S1 = PCM13SMTR:PCM13SMTR: PCM Series SP3T On-On-On Right Angle Gull Wing SMT Ultraminiature Slide Switch; DESCRIPTION: Slide Switch SP3T Surface Mount, Right Angle; DIGI-KEY_PART_NUMBER: 401-2017-1-ND; MF: C & K COMPONENTS; MP: PCM13SMTR; MPN: PCM13SMTR; OC_NEWARK: 35AH4616; PACKAGE: None
S2 = EVQ-P7L01P:EVQ-P7L01P: Switch Tactile N.O. SPST Rectangular Button Gull Wing 0.05A 12VDC 100000Cycle 1.6N SMD Embossed T/R Buy Part <https://snapeda.com/parts/EVQ-P7L01P/Panasonic%20Electronic%20Components/view-part/?ref=eda>; AVAILABILITY: Warning; DESCRIPTION: Tactile Switch SPST-NO Side Actuated Surface Mount, Right Angle; MF: PANASONIC; MOUSER-PURCHASE-URL: https://snapeda.com/shop?store=Mouser&id=3622449; MP: EVQ-P7L01P; MPN: EVQP7L01P; OC_NEWARK: 57AC6749; PACKAGE: None; PRICE: None
SIM2 = Arduino-connectors:SIM: SIM connector; CODE-BCE: -; CODE-TK2: -; DATASHEET: http://www.te.com/commerce/DocumentDelivery/DDEController?Action=srchrtrv&DocNm=2199337&DocType=Customer+Drawing&DocLang=English; DISTRIBUTOR-LINK: https://www.digikey.com/product-detail/en/te-connectivity-amp-connectors/2199337-5/A125065CT-ND/6810766; DISTRIBUTOR-PN: A125065CT-ND; MANUFACTURER: TE; MANUFACTURER-PN: 2199337-5; OC_NEWARK: unknown
SV1 = con-lstb:MA08-2: PIN HEADER; OC_FARNELL: unknown; OC_NEWARK: unknown
U2 = microbuilder:VREG_SOT23-5: SOT23-5 Fixed Voltage Regulators Part Current Out V Out V In V Dropout θJA (°C/W) TJ (°C) Digikey Part No. ADP121 150mA 3.3V 3.4-5.5V 0.09V @ 150mA -- -- ADP121-AUJZ33R7CT-ND ADP121 150mA 3.0V 3.1-5.5V 0.09V @ 150mA -- -- ADP121-AUJZ30R7CT-ND ADP122 300mA 3.3V 3.4-5.5V 0.085V @ 300mA -- -- ADP122AUJZ-3.3-R7CT-ND ADP1712 300mA 3.3V 3.5-5.5V 0.17V @ 300mA -- -- ADP1712AUJZ-3.3-R7TR-ND AP7311 (Low Cost) 150mA 3.3V 3.5-6V 0.15V @ 150mA -- -- AP7311-33WG-7DICT-ND LD39015M18R 150mA 1.8V 1.9V-5.5V 0.08V @ 100mA -- -- 497-6977-1-ND LP2985A-33DBVR 150mA 3.3V 3.3-16V 0.28V @ 150mA 206 150 296-18479-1-ND MCP1824T-3302E/OT 300mA 3.3V 3.5V-6V 0.2V @ 300mA -- -- MCP1824T-3302E/OTCT-ND MIC5205-2.5YM5 TR 150mA 2.5V 2.7-16V 0.165V @ 150mA -- -- 576-1257-2-ND MIC5205-3.0YM5 TR 150mA 3.0V 3.2V-16V 0.165V @ 150mA -- -- 576-1258-2-ND MIC5205-3.3YM5 TR 150mA 3.3V 3.5V-16V 0.165V @ 150mA -- -- 576-1259-2-ND TPS780330220 150mA 3.3V+2.2V 3.6-5.5V 250mV Max -- -- 296-23332-1-ND TDA3663/N1,135 100mA 3.3V 3.5-45V 0.18V @ 50mA -- -- 568-5343-1-ND Max operating temp can be calculated using θJA, TJ (max junction temperature), and power in watts. Set the "Maximum Ambient Temperature" until it reaches TJ ("Max Junction Temperature"), which is the absolute limit for safe use of the regulator: Heat Sink Temperature Calculator <http://www.daycounter.com/Calculators/Heat-Sink-Temperature-Calculator.phtml> For example, With 12V source into a 3.3V LP2985 and a 30mA load, we are dissipating (12V-3.3V) * 0.03A = 0.261W. With a θJA of 206 °C/W, a TJ of 150°C, and 261mW we can safely use the chip without a heat sink up to 75°C (=147.1°C Junction Temperature).; OC_NEWARK: unknown
U3 = microbuilder:MCP73831/2: MCP73831/2 LIPO Charger VDD: 3.75 - 6V Temp -40 - 85°C Programmable Charge Rate: 15-500mA NOTE: STAT is a tri-state logic output on the MCP73831 and an open-drain output on the MCP73832. SOT23-5 with 4.2V output and tri-state logic on STAT = MCP73831T-2ACI/OT; MF: MICROCHIP; MPN: MCP73831T-2ACI/OT; OC_NEWARK: 56K7045
U4 = LARA-R2:LARA-R2: LARA-R2 series: Size-optimized LTE Cat 1 modules in single and multi-mode configurations; AVAILABILITY: Unavailable; DESCRIPTION: Cellular 4G LTE CAT-1 (Verizon) Transceiver Module 900MHz, 1.8GHz Antenna Not Included, Castellation Surface Mount; MP: LARA-R2; OC_NEWARK: unknown; PACKAGE: SMD-100 U-Blox America; PRICE: None
U5 = MAX9860ETG_:MAX9860ETG+: Audio Codec 1ADC / 2DAC 16-Bit 24-Pin TQFN EP; AVAILABILITY: Unavailable; DESCRIPTION: Audio Interface 16 b Serial 24-TQFN (4x4); MF: MAXIM INTEGRATED PRODUCTS; MP: MAX9860ETG+; MPN: MAX9860ETG+; OC_NEWARK: 99AC0368; PACKAGE: TQFN-24 Maxim; PRICE: None
U6 = SN74AVC4T774PW:SN74AVC4T774PW: Check prices <https://pricing.snapeda.com/search/part/SN74AVC4T774PW/?ref=eda>; AVAILABILITY: Good; DESCRIPTION: 4-bit dual-supply bus transceiver with configurable voltage-level shifting and 3-state outputs 16-TSSOP -40 to 85; MF: Texas Instruments; MP: SN74AVC4T774PW; PACKAGE: TSSOP-16 Texas Instruments; PRICE: None; PURCHASE-URL: https://pricing.snapeda.com/search/part/SN74AVC4T774PW/?ref=eda
X1 = con-coax:BU-SMA-H: FEMALE SMA CONNECTOR Radiall; OC_FARNELL: unknown; OC_NEWARK: unknown
X2 = con-garry:332-06: 6 Pin - 2mm Dual Row Source: www.mpe-connector.de / garry_shortform_2012.pdf
X3 = 2173157-3:2173157-3: Conn Micro USB 2.0 Type B RCP 5 POS 0.65mm Solder RA SMD 5 Terminal 1 Port T/R Check prices <https://pricing.snapeda.com/search/part/2173157-3/?ref=eda>; AVAILABILITY: Good; CENTERLINE_PITCH: .65 mm[.025 in]; COMMENT: 2173157-3; DESCRIPTION: Conn Micro USB 2.0 Type B RCP 5 POS 0.65mm Solder RA SMD 5 Terminal 1 Port T/R; EU_ROHS_COMPLIANCE: Compliant; MF: TE Connectivity; MP: 2173157-3; NUMBER_OF_POSITIONS: 5; PACKAGE: None; PRICE: None; PRODUCT_TYPE: Connector; PURCHASE-URL: https://pricing.snapeda.com/search/part/2173157-3/?ref=eda
X4 = microbuilder:ANTENNA_U.FL: U.FL Antenna Connector; MF: HIROSE(HRS); MPN: U.FL-R-SMT-1(10); OC_NEWARK: 50P8856
X6 = microbuilder:CON_JST_PH_2PIN: JST 2-Pin Right-Angle Connector PH-Series - 4UConnector: 17311 SH-Series - 4UConnector: 07278; OC_NEWARK: unknown
Y1 = CSTNE8M00GH5C000R0:CSTNE8M00GH5C000R0: 8MHz Ceramic Resonator Built in Capacitor 33pF ±0.13% 40 Ohms -40°C ~ 125°C Surface Mount Check prices <https://pricing.snapeda.com/search/part/CSTNE8M00GH5C000R0/?ref=eda>; AVAILABILITY: Good; DESCRIPTION: 8MHz Ceramic Resonator Built in Capacitor 33pF ±0.13% 40 Ohms -40°C ~ 125°C Surface Mount; MF: Murata; MP: CSTNE8M00GH5C000R0; PACKAGE: SMD-3 Murata; PRICE: None; PURCHASE-URL: https://pricing.snapeda.com/search/part/CSTNE8M00GH5C000R0/?ref=eda

## Net classes
0 default: width 0.19 mm, drill 0.19 mm